# EAGLE design pressure-sensor-mpxv7007 (EAGLE 9.0.0)
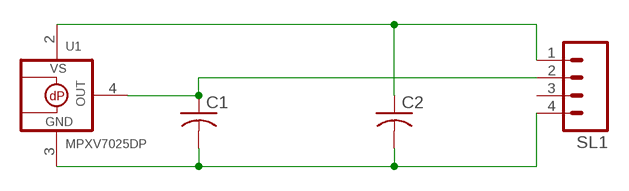
[diagram p0: schematic, sheet 1]

## Parts
C1  C-USC0805  [C0805]
C2  C-USC0603  [C0603]
SL1  M04  [04P]
U1  MPXV7025DP  [SOP8-1351]

## Nets
GND: C1.2 C2.2 SL1.4 U1.3(GND)
N$3: C2.1 SL1.1 U1.2(VS)
N$4: C1.1 SL1.2 U1.4(+VOUT)
Unconnected: SL1.3

## Library data of the parts
C1 C2 = adafruit:C-US: CAPACITOR, American symbol
SL1 = con-amp-quick:M04: AMP QUICK CONNECTOR; OC_FARNELL: unknown; OC_NEWARK: unknown
U1 = MPXV7025DP:MPXV7025DP: PRESSURE SENSOR - Differential Input, Single-Ended Output; AVAILABILITY: Unavailable; DESCRIPTION: Pressure Sensor 0.2V to 4.7V -25kPa to 25kPa Differential 8-Pin SNSR Tray; MF: Freescale Semiconductor; MP: MPXV7025DP; PACKAGE: SMD-8 Freescale Semiconductor; PRICE: None

## Board
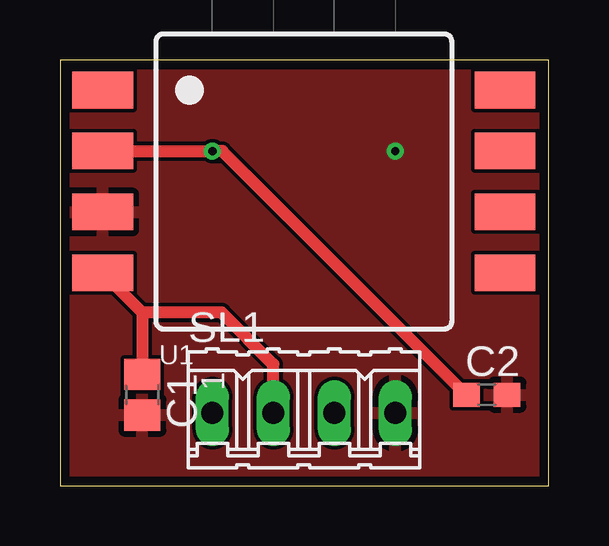
[diagram p1: board, top side]
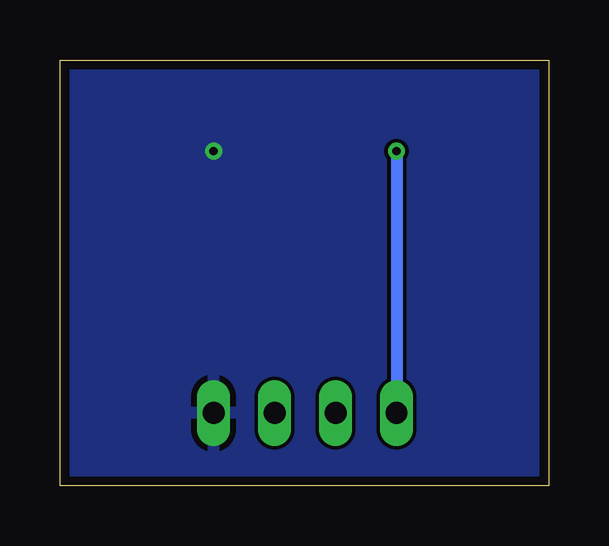
[diagram p2: board, bottom side, seen from below]

Size 20.37 x 17.77 mm. Coordinates in mm from the lower left corner, seen from the top.
Outline: 0,0 20.37,0 20.37,17.77 0,17.77 0,0
Copper layers (1*16): Top 0.0356mm / dielectric 1.5011mm / Bottom 0.0356mm
Design rules "LaenPCBOrder": minimum track width 6mil, minimum drill 13mil, track to track 6mil, track to pad 6mil, pad to pad 6mil, via to via 6mil, smd to smd 6mil, copper to edge 15mil, drill to drill 6mil, minimum pad ring 7mil, minimum via ring 7mil, stop-mask expansion 4mil, vias tented up to drill 0mil, thermal gap 10mil

### Footprints (pad centres in the part's own frame; a part is rotated, then mirrored left to right if it is on the bottom)
C0805 = smd 1.3 x 1.5: 1 -0.85,0; 2 0.85,0
C0603 = smd 1.1 x 1: 1 -0.85,0; 2 0.85,0
04P = drill 0.914 long: 1 -3.81,0; 2 -1.27,0; 3 1.27,0; 4 3.81,0
SOP8-1351 = smd 2.54 x 1.524: 1 -8.382,3.81; 2 -8.382,1.27; 3 -8.382,-1.27; 4 -8.382,-3.81; 5 8.382,-3.81; 6 8.382,-1.27; 7 8.382,1.27; 8 8.382,3.81

### Placement (x,y rotation side)
C1  3.43,3.81 270 top
C2  17.78,3.81 0 top
SL1  10.16,3.05 0 top
U1  10.16,12.7 0 top

### Tracks (layer width: path | path; a pad name or v marks a point on that pad's centre or on a via)
GND  (via drill 0.35)
  other vias: 13.97,13.97
  pour Top: 0,17.78 0,0 20.32,0 20.32,17.78
  pour Bottom: 0,17.78 20.32,17.78 20.32,0 0,0
N$3  (via drill 0.35)
  Top 0.508: U1.2 v6.35,13.97 6.77,13.97 C2.1
  Bottom 0.508: v6.35,13.97 SL1.1
N$4
  Top 0.508: U1.4 3.43,7.24 | 3.43,7.24 C1.1 | SL1.2 8.89,5.08 6.73,7.24 3.43,7.24